# Altium schematic sheet Power_Board_DRV8323.SchDoc
size A4; SheetNumber: 1; SheetTotal: 1
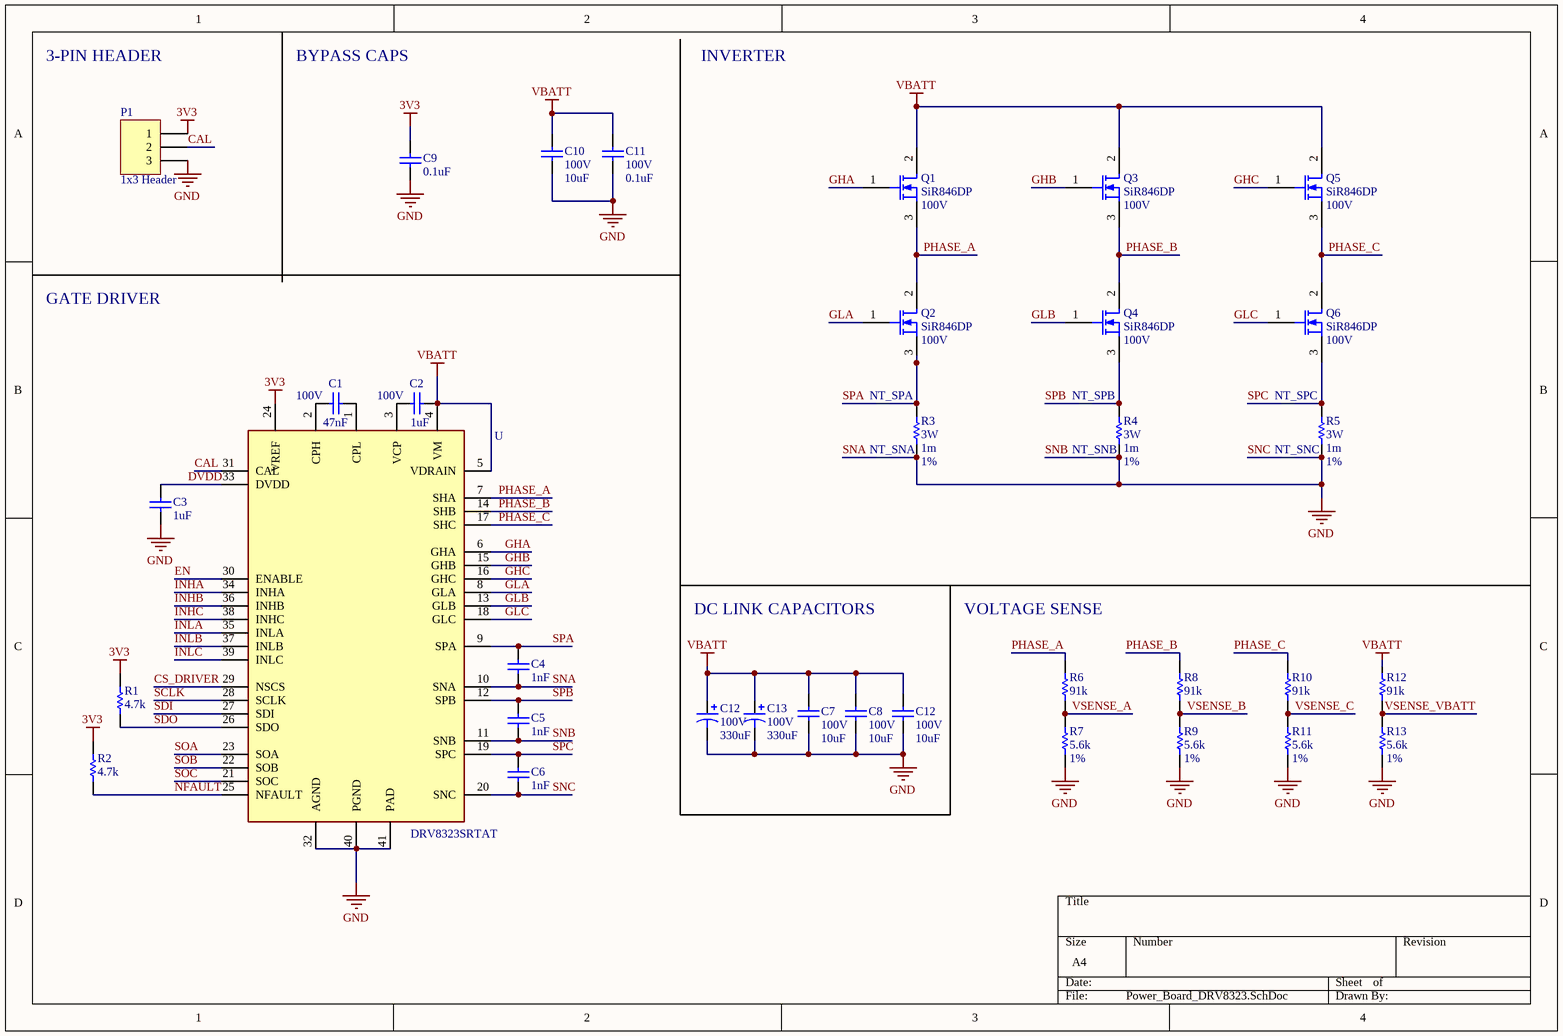
[diagram p0: Power_Board_DRV8323.SchDoc]

## Parts
(Parts that share a designator on the sheet are numbered #1, #2 ... from top to bottom, then left to right.)
C1  value 47nF  Rating: 100V  [0805 - Capacitor]  (hidden comment: Capacitor - Nonpolarized)
C2  value 1uF  Rating: 100V  [0805 - Capacitor]  (hidden comment: Capacitor - Nonpolarized)
C3  value 1uF  [0805 - Capacitor]  (hidden comment: Capacitor - Nonpolarized)
C4  value 1nF  [0805 - Capacitor]  (hidden comment: Capacitor - Nonpolarized)
C5  value 1nF  [0805 - Capacitor]  (hidden comment: Capacitor - Nonpolarized)
C6  value 1nF  [0805 - Capacitor]  (hidden comment: Capacitor - Nonpolarized)
C7  value 10uF  Rating: 100V  [0805 - Capacitor]  (hidden comment: Capacitor - Nonpolarized)
C8  value 10uF  Rating: 100V  [0805 - Capacitor]  (hidden comment: Capacitor - Nonpolarized)
C9  value 0.1uF  [0805 - Capacitor]  (hidden comment: Capacitor - Nonpolarized)
C10  value 10uF  Rating: 100V  [0805 - Capacitor]  (hidden comment: Capacitor - Nonpolarized)
C11  value 0.1uF  Rating: 100V  [0805 - Capacitor]  (hidden comment: Capacitor - Nonpolarized)
C12#1  value 330uF  Rating: 100V  [OCVZ0606 - CAPACITOR]  (hidden comment: Capacitor - Polarized)
C12#2  value 10uF  Rating: 100V  [0805 - Capacitor]  (hidden comment: Capacitor - Nonpolarized)
C13  value 330uF  Rating: 100V  [OCVZ0606 - CAPACITOR]  (hidden comment: Capacitor - Polarized)
NT_SNA  NetTie  [Net Tie]  (value not drawn)  (net tie, no BOM)
NT_SNB  NetTie  [Net Tie]  (value not drawn)  (net tie, no BOM)
NT_SNC  NetTie  [Net Tie]  (value not drawn)  (net tie, no BOM)
NT_SPA  NetTie  [Net Tie]  (value not drawn)  (net tie, no BOM)
NT_SPB  NetTie  [Net Tie]  (value not drawn)  (net tie, no BOM)
NT_SPC  NetTie  [Net Tie]  (value not drawn)  (net tie, no BOM)
P1  1x3 Header  [HDR1X3]
Q1  Supplier Part Number: SiR846DP  Rating: 100V  [PowerPAK® SO-8]  (hidden comment: MOSFET-N)
Q2  Supplier Part Number: SiR846DP  Rating: 100V  [PowerPAK® SO-8]  (hidden comment: MOSFET-N)
Q3  Supplier Part Number: SiR846DP  Rating: 100V  [PowerPAK® SO-8]  (hidden comment: MOSFET-N)
Q4  Supplier Part Number: SiR846DP  Rating: 100V  [PowerPAK® SO-8]  (hidden comment: MOSFET-N)
Q5  Supplier Part Number: SiR846DP  Rating: 100V  [PowerPAK® SO-8]  (hidden comment: MOSFET-N)
Q6  Supplier Part Number: SiR846DP  Rating: 100V  [PowerPAK® SO-8]  (hidden comment: MOSFET-N)
R1  value 4.7k  [0603 - Resistor]  (hidden comment: Resistor)
R2  value 4.7k  [0603 - Resistor]  (hidden comment: Resistor)
R3  value 1m  Rating: 3W  Tolerance: 1%  [2512 - RESISTOR]  (hidden comment: Resistor)
R4  value 1m  Rating: 3W  Tolerance: 1%  [2512 - RESISTOR]  (hidden comment: Resistor)
R5  value 1m  Rating: 3W  Tolerance: 1%  [2512 - RESISTOR]  (hidden comment: Resistor)
R6  value 91k  [0603 - Resistor]  (hidden comment: Resistor)
R7  value 5.6k  Tolerance: 1%  [0603 - Resistor]  (hidden comment: Resistor)
R8  value 91k  [0603 - Resistor]  (hidden comment: Resistor)
R9  value 5.6k  Tolerance: 1%  [0603 - Resistor]  (hidden comment: Resistor)
R10  value 91k  [0603 - Resistor]  (hidden comment: Resistor)
R11  value 5.6k  Tolerance: 1%  [0603 - Resistor]  (hidden comment: Resistor)
R12  value 91k  [0603 - Resistor]  (hidden comment: Resistor)
R13  value 5.6k  Tolerance: 1%  [0603 - Resistor]  (hidden comment: Resistor)
U  DRV8323SRTAT  [DRV8323SRTAT]

## Nets
3V3: C9.1 P1.1 R1.2 R2.2 U.24(VREF)
GND: C3.1 C7.2 C8.2 C9.2 C10.2 C11.2 C12#1.2 C12#2.2 C13.2 NT_SNA.2 NT_SNB.2 NT_SNC.2 P1.3 R3.1 R4.1 R5.1 R7.2 R9.2 R11.2 R13.2 U.32(AGND) U.40(PGND) U.41(PAD)
VBATT: C2.2 C7.1 C8.2 C10.2 C11.2 C12#1.1 C12#2.2 C13.1 Q1.2(D) Q3.2(D) Q5.2(D) R12.1 U.4(VM) U.5(VDRAIN)
CAL: P1.2 U.31(CAL)
CS_DRIVER: U.29(NSCS)
DVDD: C3.2 U.33(DVDD)
EN: U.30(ENABLE)
GHA: Q1.1(G) U.6(GHA)
GHB: Q3.1(G) U.15(GHB)
GHC: Q5.1(G) U.16(GHC)
GLA: Q2.1(G) U.8(GLA)
GLB: Q4.1(G) U.13(GLB)
GLC: Q6.1(G) U.18(GLC)
INHA: U.34(INHA)
INHB: U.36(INHB)
INHC: U.38(INHC)
INLA: U.35(INLA)
INLB: U.37(INLB)
INLC: U.39(INLC)
NFAULT: R2.1 U.25(NFAULT)
PHASE_A: Q1.3(S) Q2.2(D) R6.1 U.7(SHA)
PHASE_B: Q3.3(S) Q4.2(D) R8.1 U.14(SHB)
PHASE_C: Q5.3(S) Q6.2(D) R10.1 U.17(SHC)
SCLK: U.28(SCLK)
SDI: U.27(SDI)
SDO: R1.1 U.26(SDO)
SNA: C4.1 NT_SNA.1 U.10(SNA)
SNB: C5.1 NT_SNB.1 U.11(SNB)
SNC: C6.1 NT_SNC.1 U.20(SNC)
SOA: U.23(SOA)
SOB: U.22(SOB)
SOC: U.21(SOC)
SPA: C4.2 NT_SPA.1 U.9(SPA)
SPB: C5.2 NT_SPB.1 U.12(SPB)
SPC: C6.2 NT_SPC.1 U.19(SPC)
VSENSE_A: R6.2 R7.1
VSENSE_B: R8.2 R9.1
VSENSE_C: R10.2 R11.1
VSENSE_VBATT: R12.2 R13.1
NetC1_1: C1.1 U.2(CPH)
NetC1_2: C1.2 U.1(CPL)
NetC2_1: C2.1 U.3(VCP)
NetNT_SPA_2: NT_SPA.2 Q2.3(S) R3.2
NetNT_SPB_2: NT_SPB.2 Q4.3(S) R4.2
NetNT_SPC_2: NT_SPC.2 Q6.3(S) R5.2

## Notes on the sheet
- 3-PIN HEADER
- BYPASS CAPS
- INVERTER
- GATE DRIVER
- DC LINK CAPACITORS
- VOLTAGE SENSE

## Library data of the parts
C1-C11 C12#2 = Capacitor - Nonpolarized: Nonpolarized Capacitor; Supplier Part Number: *; Supplier: *; Manufacturer: *; Manufacturer Part Number: *
  C3-C6 C9: Rating: *
C12#1 C13 = Capacitor - Polarized: Polarized Capacitor; Supplier: *; Supplier Part Number: *; Manufacturer: *; Manufacturer Part Number: *
NT_SNA NT_SNB NT_SNC NT_SPA NT_SPB NT_SPC = Net Tie
P1 = 1x3 Header: 1x3 Pin Header
Q1-Q6 = MOSFET-N: N-Channel MOSFET; Supplier: *; Manufacturer Part Number: *; Manufacturer: *; Value: *
R3-R5 = Resistor: Manufacturer: HCS2512FT1L00; Manufacturer Part Number: *; Supplier Part Number: HCS2512FT1L00CT-ND; Supplier: *
U = DRV8323SRTAT: Multiphase Motor Driver Power MOSFET SPI; Manufacturer: Texas Instruments; Manufacturer Part Number: DRV8323SRTAT; Supplier: Digikey; Supplier Part Number: 296-47095-1-ND; ComponentLink1Description: Datasheet; ComponentLink1URL: https://www.ti.com/lit/ds/symlink/drv8323.pdf?HQS=dis-dk-null-digikeymode-dsf-pf-null-wwe&ts=1623708117864
R1 R2 R6-R13 = Resistor: Rating: *; Manufacturer Part Number: *; Manufacturer: *; Supplier Part Number: *; Supplier: *